# Altium schematic sheet Buck_CurrentRegulator.SchDoc
size A4; SheetNumber: 4; SheetTotal: 4
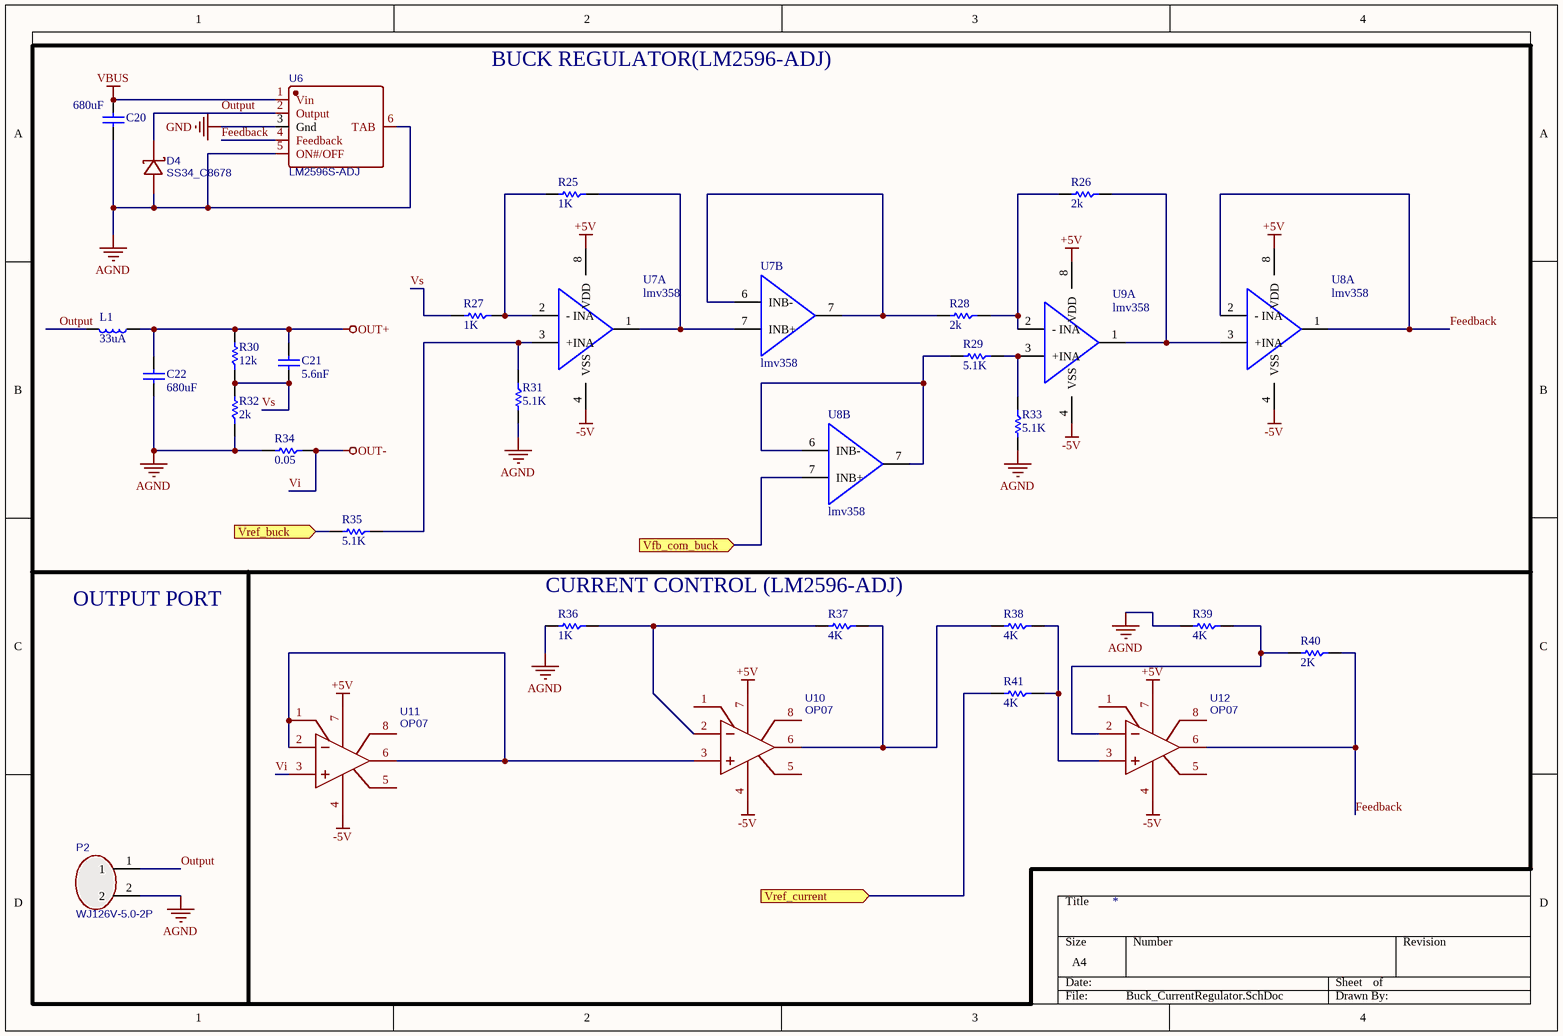
[diagram p0: Buck_CurrentRegulator.SchDoc]

## Parts
C20  680uF  [0805C]
C21  5.6nF  [0805C]
C22  680uF  [0805C]
D4  SS34_C8678  [DO-214AC_L4.3-W2.7-LS5.3-RD]
L1  33uA  [0805]
P2  WJ126V-5.0-2P  [CONN-TH_WJ126V-5.0-2P]
R25  1K  [0805]
R26  2k  [0805]
R27  1K  [0805]
R28  2k  [0805]
R29  5.1K  [0805]
R30  12k  [0805]
R31  5.1K  [0805]
R32  2k  [0805]
R33  5.1K  [0805]
R34  0.05  [0805]
R35  5.1K  [0805]
R36  1K  [0805]
R37  4K  [0805]
R38  4K  [0805]
R39  4K  [0805]
R40  2K  [0805]
R41  4K  [0805]
U6  LM2596S-ADJ  [TO-263-5_L10.2-W8.9-P1.70-BR]
U7  lmv358  [SOP-8_L4.9-W3.9-P1.27-LS6.0-BL]  (parts A,B of 2)
U8  lmv358  [SOP-8_L4.9-W3.9-P1.27-LS6.0-BL]  (parts A,B of 2)
U9  lmv358  [SOP-8_L4.9-W3.9-P1.27-LS6.0-BL]  (part A of 2)
U10  OP07  [SOP-8_L4.9-W3.9-P1.27-LS6.0-BL]
U11  OP07  [SOP-8_L4.9-W3.9-P1.27-LS6.0-BL]
U12  OP07  [SOP-8_L4.9-W3.9-P1.27-LS6.0-BL]

## Blocks framed on the sheet
BUCK REGULATOR(LM2596-ADJ): C20-C22 D4 L1 R25-R35 U6-U9

## Ports
Vfb_com_buck (in), Vref_buck (in), Vref_current (in)

## Nets
+5V: U7.8(VDD) U8.8(VDD) U9.8(VDD) U10.7(V+) U11.7(V+) U12.7(V+)
-5V: U7.4(VSS) U8.4(VSS) U9.4(VSS) U10.4(V-) U11.4(V-) U12.4(V-)
AGND: C20.2 C22.1 D4.2(A) P2.2 R31.2 R32.1 R33.2 R34.2 R36.2 R39.2 U6.5(ON#/OFF) U6.6(TAB)
GND: U6.3(Gnd)
OUT+: C21.1 C22.2 L1.1 R30.2
VBUS: C20.1 U6.1(Vin)
Vi: R34.1 U11.3(IN+)  [also labelled OUT-]
Feedback: R40.1 U6.4(Feedback) U8.1(OUTA) U8.2(-_INA) U12.6(OUT)
Output: D4.1(K) L1.2 P2.1 U6.2(Output)
Vfb_com_buck: U8.7(INB+) ; port Vfb_com_buck
Vref_buck: R35.2 ; port Vref_buck
Vref_current: R41.2 ; port Vref_current
Vs: C21.2 R27.2 R30.1 R32.2
NetR25_1: R25.1 U7.1(OUTA) U7.7(INB+)
NetR25_2: R25.2 R27.1 U7.2(-_INA)
NetR26_1: R26.1 U8.3(+INA) U9.1(OUTA)
NetR26_2: R26.2 R28.1 U9.2(-_INA)
NetR28_2: R28.2 U7.6(INB-) U7.7(OUTB)
NetR29_1: R29.1 R33.1 U9.3(+INA)
NetR29_2: R29.2 U8.6(INB-) U8.7(OUTB)
NetR31_1: R31.1 R35.1 U7.3(+INA)
NetR36_1: R36.1 R37.2 U10.2(IN-)
NetR37_1: R37.1 R38.2 U10.6(OUT)
NetR38_1: R38.1 R41.1 U12.3(IN+)
NetR39_1: R39.1 R40.2 U12.2(IN-)
NetU10_3: U10.3(IN+) U11.1(VOS_TRIM) U11.2(IN-) U11.6(OUT)

Not connected (* = marked no-connect by the designer): U10 1(VOS_TRIM) 5(NC) 8(VOS_TRIM); U11 5(NC) 8(VOS_TRIM); U12 1(VOS_TRIM) 5(NC) 8(VOS_TRIM)

## Notes on the sheet
- OUTPUT PORT
- CURRENT CONTROL (LM2596-ADJ)

## Library data of the parts
C20 = C_680uf: Capacitor; Reviewed by: RM - 2018/08/05; Revision: July-2002: Re-released for DXP Platform.; Supplier 1: *; Supplier Part Number 1: *; Value: 680uF
C21 = C_7: Capacitor; Reviewed by: RM - 2018/08/05; Revision: July-2002: Re-released for DXP Platform.; Supplier 1: *; Supplier Part Number 1: *; Value: 5.6nF
C22 = C_11: Capacitor; Reviewed by: RM - 2018/08/05; Revision: July-2002: Re-released for DXP Platform.; Supplier 1: *; Supplier Part Number 1: *; Value: 680uF
D4 = SS34_C8678: BOM_Manufacturer Part: SS34; BOM_Manufacturer: MDD; BOM_Supplier: LCSC; BOM_Supplier Part: C8678; BOM_JLCPCB Part Class: Basic Part; spicePre: D; spiceSymbolName: SS34_C8678
L1 = I: Inductor; Reviewed by: RM - 2018/08/05; Supplier 1: *; Supplier Part Number 1: *; Value: 33uA
P2 = WJ126V-5.0-2P: BOM_Manufacturer: ReliaPro; BOM_Supplier: LCSC; BOM_Manufacturer Part: WJ126V-5.0-2P; BOM_Supplier Part: C8404; BOM_JLCPCB Part Class: Extended Part; spicePre: P; spiceSymbolName: WJ126V-5.0-2P
R25 R27 R34 = R_6: Resistor; Reviewed by: RM - 2018/08/05; Supplier 1: *; Suppler Part Number 1: *
  R25 R27: Value: 1K
  R34: Value: 0.05
R26 R28 R32 = R_3: Resistor; Reviewed by: RM - 2018/08/05; Supplier 1: *; Suppler Part Number 1: *; Value: 2k
R29 R31 R33 R35 = R_1: Resistor; Reviewed by: RM - 2018/08/05; Supplier 1: *; Suppler Part Number 1: *; Value: 5.1K
R30 = R_2: Resistor; Reviewed by: RM - 2018/08/05; Supplier 1: *; Suppler Part Number 1: *; Value: 12k
R36-R41 = R_1k: Resistor; Reviewed by: RM - 2018/08/05; Supplier 1: *; Suppler Part Number 1: *
  R36: Value: 1K
  R37-R39 R41: Value: 4K
  R40: Value: 2K
U6 = LM2596S-ADJ: BOM_Manufacturer: UMW(Youtai Semiconductor Co., Ltd.); Contributor: LCSC; BOM_Supplier: LCSC; BOM_Supplier Part: C347423; BOM_Manufacturer Part: LM2596S-ADJ; BOM_JLCPCB Part Class: Extended Part; spicePre: U; spiceSymbolName: LM2596S-ADJ
U7-U9 = LMV358-SR: OpAmp High Frequency Dual; Reviewed by: RM - 2018/08/05
U10-U12 = OP07: BOM_Manufacturer: Hangzhou Ruimeng Tech; Contributor: LCSC; BOM_Supplier: LCSC; BOM_Supplier Part: C1508997; BOM_Manufacturer Part: OP07; BOM_JLCPCB Part Class: Extended Part; spicePre: U; spiceSymbolName: OP07